# Altium schematic sheet PicoCore-S3.SchDoc
size A3; SheetNumber: 1; SheetTotal: 1
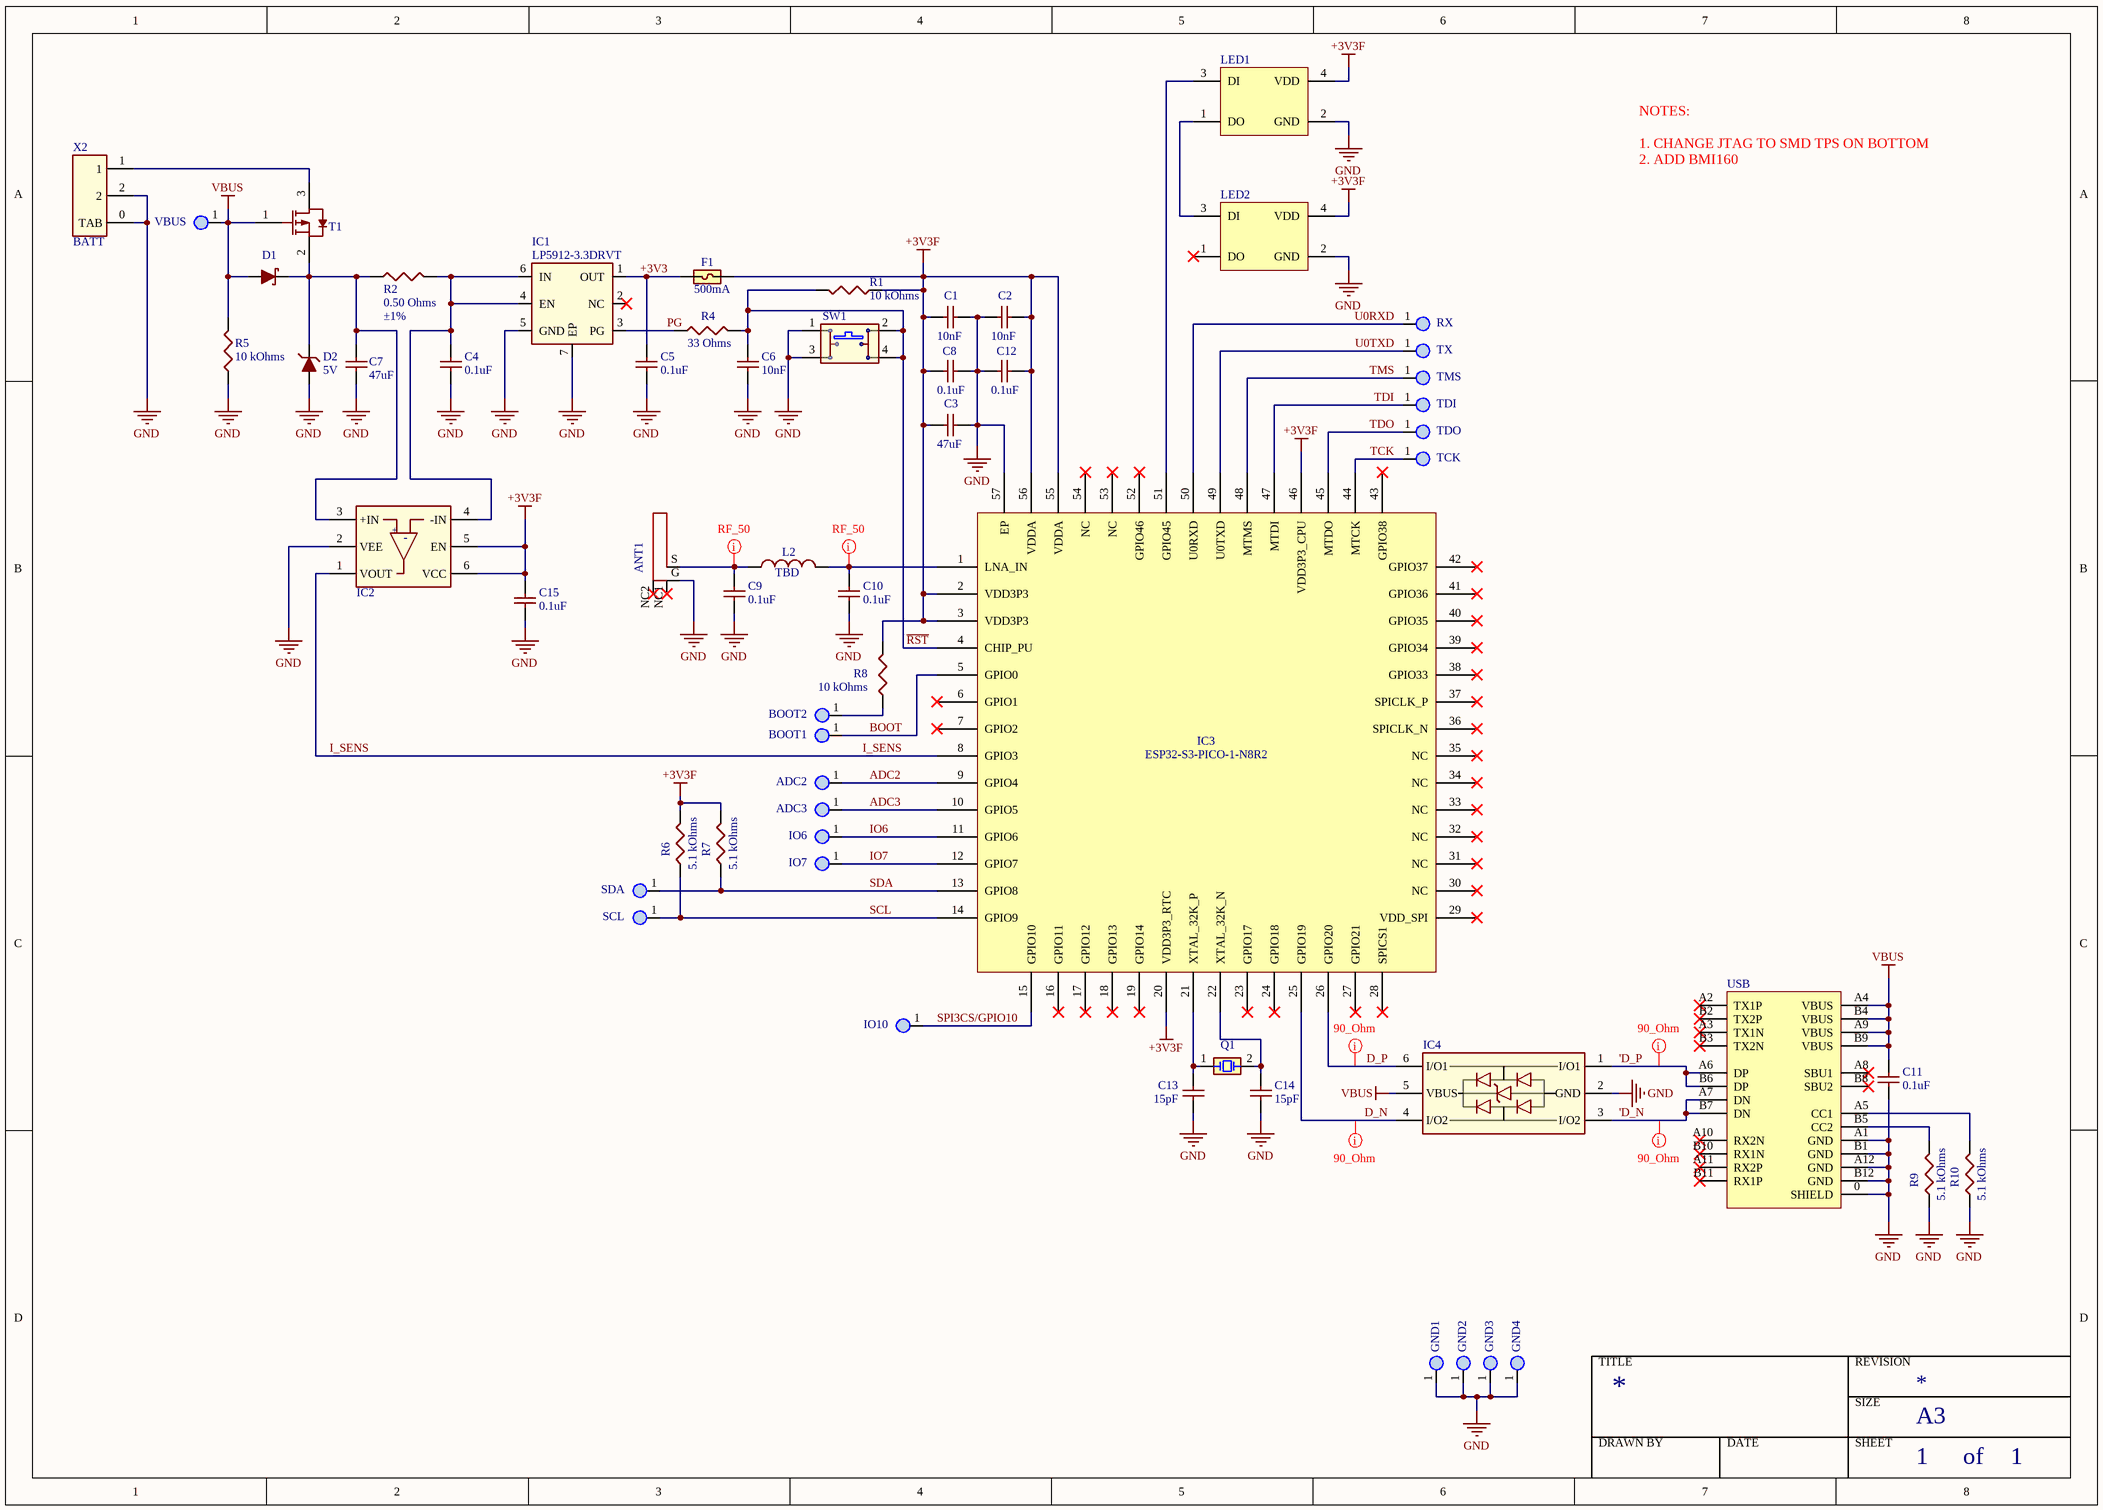
[diagram p0: PicoCore-S3.SchDoc]

## Parts
ADC2  CASTELLATED PAD  [CASTELLATED PAD]  (value not drawn)
ADC3  CASTELLATED PAD  [CASTELLATED PAD]  (value not drawn)
ANT1  RF ANT 2.4GHZ STAMPED MET SLD  [PRO-OB-440]  (value not drawn)
BOOT1  CASTELLATED PAD  [CASTELLATED PAD]  (value not drawn)
BOOT2  CASTELLATED PAD  [CASTELLATED PAD]  (value not drawn)
C1  Electrical Value: 10nF  [CAP_0402_IPC]  (hidden comment: CAP NP)
C2  Electrical Value: 10nF  [CAP_0402_IPC]  (hidden comment: CAP NP)
C3  Electrical Value: 47uF  [CAP_1206_IPC]  (hidden comment: CAP NP)
C4  Electrical Value: 0.1uF  [CAP_0402_IPC]  (hidden comment: CAP NP)
C5  Electrical Value: 0.1uF  [CAP_0402_IPC]  (hidden comment: CAP NP)
C6  Electrical Value: 10nF  [CAP_0402_IPC]  (hidden comment: CAP NP)
C7  Electrical Value: 47uF  [CAP_1206_IPC]  (hidden comment: CAP NP)
C8  Electrical Value: 0.1uF  [CAP_0402_IPC]  (hidden comment: CAP NP)
C9  Electrical Value: 0.1uF  [CAP_0402_IPC]  (hidden comment: CAP NP)
C10  Electrical Value: 0.1uF  [CAP_0402_IPC]  (hidden comment: CAP NP)
C11  Electrical Value: 0.1uF  [CAP_0402_IPC]  (hidden comment: CAP NP)
C12  Electrical Value: 0.1uF  [CAP_0402_IPC]  (hidden comment: CAP NP)
C13  Electrical Value: 15pF  [CAP_0603_IPC]  (hidden comment: CAP NP)
C14  Electrical Value: 15pF  [CAP_0603_IPC]  (hidden comment: CAP NP)
C15  Electrical Value: 0.1uF  [CAP_0402_IPC]  (hidden comment: CAP NP)
D1  DIODE_SCHOTTKY  [SOD-123_IPC]  (value not drawn)
D2  Electrical Value: 5V  [SOD-523_IPC]  (hidden comment: DIODE_TVS_UNI)
F1  Rating1 Value: 500mA  [PTC_1206_IPC]  (hidden comment: FUSE)
GND1  CASTELLATED PAD  [CASTELLATED PAD]  (value not drawn)
GND2  CASTELLATED PAD  [CASTELLATED PAD]  (value not drawn)
GND3  CASTELLATED PAD  [CASTELLATED PAD]  (value not drawn)
GND4  CASTELLATED PAD  [CASTELLATED PAD]  (value not drawn)
IC1  Primary Manufacturer Part Number: LP5912-3.3DRVT  [SON6_0P65_EP_IPC]  (hidden comment: LP5912-3.3)
IC2  NCV2002SN2T1  [TSOP6_0P95_IPC]  (value not drawn)
IC3  RF TXRX MOD BLUETOOTH WIFISMD  [LGA56]  (value not drawn)
IC4  USBLC6-2P6  [SOT666_IPC]  (value not drawn)
IO6  CASTELLATED PAD  [CASTELLATED PAD]  (value not drawn)
IO7  CASTELLATED PAD  [CASTELLATED PAD]  (value not drawn)
IO10  CASTELLATED PAD  [CASTELLATED PAD]  (value not drawn)
L2  TBD  [IND_0805_IPC]
LED1  ADDRESS LED DISCRETE RGB  [WS2812B-2020]  (value not drawn)
LED2  ADDRESS LED DISCRETE RGB  [WS2812B-2020]  (value not drawn)
Q1  CRYSTAL_H_2PIN  [XTAL_ECX-34Q]  (value not drawn)
R1  Electrical Value: 10 kOhms  [RES_0402_IPC]  (hidden comment: RES)
R2  Electrical Value: 0.50 Ohms  Tolerance %: ±1%  [RES_1206_IPC]  (hidden comment: RES)
R4  Electrical Value: 33 Ohms  [RES_0402_IPC]  (hidden comment: RES)
R5  Electrical Value: 10 kOhms  [RES_0402_IPC]  (hidden comment: RES)
R6  Electrical Value: 5.1 kOhms  [RES_0402_IPC]  (hidden comment: RES)
R7  Electrical Value: 5.1 kOhms  [RES_0402_IPC]  (hidden comment: RES)
R8  Electrical Value: 10 kOhms  [RES_0402_IPC]  (hidden comment: RES)
R9  Electrical Value: 5.1 kOhms  [RES_0402_IPC]  (hidden comment: RES)
R10  Electrical Value: 5.1 kOhms  [RES_0402_IPC]  (hidden comment: RES)
RX  CASTELLATED PAD  [CASTELLATED PAD]  (value not drawn)
SCL  CASTELLATED PAD  [CASTELLATED PAD]  (value not drawn)
SDA  CASTELLATED PAD  [CASTELLATED PAD]  (value not drawn)
SW1  SW-RESET  [SW_KMR231GLFS]  (value not drawn)
T1  MOSFET_P-CH  [SOT23-3_IPC]  (value not drawn)
TCK  CASTELLATED PAD  [CASTELLATED PAD]  (value not drawn)
TDI  CASTELLATED PAD  [CASTELLATED PAD]  (value not drawn)
TDO  CASTELLATED PAD  [CASTELLATED PAD]  (value not drawn)
TMS  CASTELLATED PAD  [CASTELLATED PAD]  (value not drawn)
TX  CASTELLATED PAD  [CASTELLATED PAD]  (value not drawn)
USB  CONN RCP USB3.1 TYPEC 24P SMD RA  [12401832E402A]  (value not drawn)
VBUS  CASTELLATED PAD  [CASTELLATED PAD]  (value not drawn)
X2  BATT  [CONN_2POS_SM02B]

## Nets
+3V3F: C1.2 C2.1 C3.2 C8.2 C12.1 C15.2 F1.2 IC2.5(EN) IC2.6(VCC) IC3.2(VDD3P3) IC3.3(VDD3P3) IC3.20(VDD3P3_RTC) IC3.46(VDD3P3_CPU) IC3.55(VDDA) IC3.56(VDDA) LED1.4(VDD) LED2.4(VDD) R1.1 R6.2 R7.2 R8.2
GND: ANT1.G C1.1 C2.2 C3.1 C4.1 C5.1 C6.2 C7.2 C8.1 C9.1 C10.1 C11.1 C12.2 C13.1 C14.1 C15.1 D2.2(A) GND1.1 GND2.1 GND3.1 GND4.1 IC1.5(GND) IC1.7(EP) IC2.2(VEE) IC3.57(EP) IC4.2(GND) LED1.2(GND) LED2.2(GND) R5.1 R9.1 R10.1 SW1.1 SW1.3 USB.0(SHIELD) USB.A1(GND) USB.A12(GND) USB.B1(GND) USB.B12(GND) X2.0(TAB) X2.2
VBUS: C11.2 D1.2(A) IC4.5(VBUS) R5.2 T1.1(G) USB.A4(VBUS) USB.A9(VBUS) USB.B4(VBUS) USB.B9(VBUS) VBUS.1
'D_N: IC4.3(I/O2) USB.A7(DN) USB.B7(DN)
'D_P: IC4.1(I/O1) USB.A6(DP) USB.B6(DP)
+3V3: C5.2 F1.1 IC1.1(OUT)
ADC2: ADC2.1 IC3.9(GPIO4)
ADC3: ADC3.1 IC3.10(GPIO5)
BOOT: BOOT1.1 IC3.5(GPIO0)
D_N: IC3.25(GPIO19) IC4.4(I/O2)
D_P: IC3.26(GPIO20) IC4.6(I/O1)
I_SENS: IC2.1(VOUT) IC3.8(GPIO3)
IO6: IC3.11(GPIO6) IO6.1
IO7: IC3.12(GPIO7) IO7.1
PG: IC1.3(PG) R4.1
~{RST}: C6.1 IC3.4(CHIP_PU) R1.2 R4.2 SW1.2 SW1.4
SCL: IC3.14(GPIO9) R6.1 SCL.1
SDA: IC3.13(GPIO8) R7.1 SDA.1
SPI3CS/GPIO10: IC3.15(GPIO10) IO10.1
TCK: IC3.44(MTCK) TCK.1
TDI: IC3.47(MTDI) TDI.1
TDO: IC3.45(MTDO) TDO.1
TMS: IC3.48(MTMS) TMS.1
U0RXD: IC3.50(U0RXD) RX.1
U0TXD: IC3.49(U0TXD) TX.1
NetANT1_S: ANT1.S C9.2 L2.1
NetBOOT2_1: BOOT2.1 R8.1
NetC4_2: C4.2 IC1.4(EN) IC1.6(IN) IC2.4(-IN) R2.2
NetC7_1: C7.1 D1.1(K) D2.1(K) IC2.3(+IN) R2.1 T1.2(S)
NetC10_2: C10.2 IC3.1(LNA_IN) L2.2
NetC13_2: C13.2 IC3.21(XTAL_32K_P) Q1.1(I/O@1)
NetC14_2: C14.2 IC3.22(XTAL_32K_N) Q1.2(I/O@2)
NetIC3_51: IC3.51(GPIO45) LED1.3(DI)
NetLED1_1: LED1.1(DO) LED2.3(DI)
NetR9_2: R9.2 USB.B5(CC2)
NetR10_2: R10.2 USB.A5(CC1)
NetT1_3: T1.3(D) X2.1

Not connected (* = marked no-connect by the designer): ANT1 NC1* NC2*; IC1 2(NC)*; IC3 6(GPIO1)* 7(GPIO2)* 16(GPIO11)* 17(GPIO12)* 18(GPIO13)* 19(GPIO14)* 23(GPIO17)* 24(GPIO18)* 27(GPIO21)* 28(SPICS1)* 29(VDD_SPI)* 30(NC)* 31(NC)* 32(NC)* 33(NC)* 34(NC)* 35(NC)* 36(SPICLK_N)* 37(SPICLK_P)* 38(GPIO33)* 39(GPIO34)* 40(GPIO35)* 41(GPIO36)* 42(GPIO37)* 43(GPIO38)* 52(GPIO46)* 53(NC)* 54(NC)*; LED2 1(DO)*; USB A2(TX1P)* A3(TX1N)* A8(SBU1)* A10(RX2N)* A11(RX2P)* B2(TX2P)* B3(TX2N)* B8(SBU2)* B10(RX1N)* B11(RX1P)*

## Layout directives
net class DIFF_90: 'D_N, 'D_P, D_N, D_P
net class RF_50: NetANT1_S, NetC10_2

## Notes on the sheet
- NOTES:
  1. CHANGE JTAG TO SMD TPS ON BOTTOM
  2. ADD BMI160
- TITLE
- REVISION
- DRAWN BY
- DATE
- SHEET
- SIZE
- A3
- of
- (in symbol NCV2002SN2T1G) +; -

## Library data of the parts
ADC2 ADC3 BOOT1 BOOT2 GND1-GND4 IO6 IO7 IO10 RX SCL SDA TCK TDI TDO TMS TX VBUS = CASTELLATED_PAD
ANT1 = PRO-OB-440: RF ANTENNA Bluetooth, WirelessHART, WLAN, Zigbee™ Stamped Metal Solder Surface Mount; Primary Manufacturer: Abracon; Primary Manufacturer Part Number: PRO-OB-440; Electrical Value: 2.4 GHz
C1 C2 C6 = CGA2B3X7R1H103K050BB: CAP CER 10nF 10% 50V X7R 0402; Methode Part Number: 18191XA86; Primary Manufacturer: TDK Corporation; Part Height in mm: 0.55; Temperature  Min C: -55; Temperature  Max C: 125; Qualification: AEC-Q200; Primary Manufacturer Part Number: CGA2B3X7R1H103K050BB; Rating1 Value: 50V; Package: 0402; Tolerance %: ±10%; ROHS Compliant: True
C3 C7 = C3216X5R1E476M160AC: Capacitor Ceramic 47UF 25V 20% X5R 1206; Methode Part Number: TBD; Primary Manufacturer: Kemet; Part Height in mm: 1.8; Temperature  Min C: -55; Temperature  Max C: 85; Qualification: General purpose; Primary Manufacturer Part Number: C3216X5R1E476M160AC; Rating1 Value: 25V; Package: 1206; Tolerance %: ±20%; ROHS Compliant: True
C4 C5 C8-C12 C15 = GCM155R71H104KE02D: CAP CER 0.1uF 10% 50V X7R 0402; Methode Part Number: 18191XA98; Primary Manufacturer: Murata Electronics North America; Part Height in mm: 0.55; Temperature  Min C: -55; Temperature  Max C: 125; Qualification: AEC-Q200; Primary Manufacturer Part Number: GCM155R71H104KE02D; Rating1 Value: 50V; Package: 0402; Tolerance %: ±10%; ROHS Compliant: True
C13 C14 = C0603C150J5GACTU: Capacitor Ceramic NPO, SMT, 15PF, 50V, 5%, 0603; Primary Manufacturer: KEMET CHARGED ELECTRONICS; Part Height in mm: 0.8; Temperature  Min C: -55; Temperature  Max C: 125; Qualification: NO; Primary Manufacturer Part Number: C0603C150J5GACTU; Rating1 Value: 50V; Package: 0603; Tolerance %: 5%; ROHS Compliant: True
D1 = MBR0540-TP: DIODE SCHOTTKY 40V 500MA SOD123; Methode Part Number: TBD; Primary Manufacturer: Micro Commercial Co; Part Height in mm: 1.35; Temperature  Min C: -55; Temperature  Max C: 150; Certification: UL 94V-0; Qualification: General purpose; Primary Manufacturer Part Number: MBR0540-TP; Electrical Value: 40V; Rating1 Value: 500mA; Package: SOD123; ROHS Compliant: True
D2 = ESD5Z5.0T1G: Zener Diode, SMT, TVS, ESD, 5.0V, SOD-523; Methode Part Number: 16441XA7; Primary Manufacturer: ON SEMICONDUCTORS; Part Height in mm: 0.6; Rating1 Value: 200 W; Temperature  Min C: -55; Temperature  Max C: 150; Qualification: Automotive; Primary Manufacturer Part Number: ESD5Z5.0T1G; Package: SOD-523; ROHS Compliant: True
F1 = 0ZCJ0050AF2E: PTC RESET FUSE 24V 500MA 1206; Methode Part Number: TBD; Primary Manufacturer: Bel Fuse Inc.; Part Height in mm: 1.2; Temperature  Min C: -40; Temperature  Max C: 85; Qualification: AEC-Q200; Primary Manufacturer Part Number: 0ZCJ0050AF2E; Electrical Value: 24V; Package: 1206; ROHS Compliant: True
IC1 = LP5912-3.3DRVT: IC REG LDO 3.3V 0.5A 6SON; Methode Part Number: TBD; Primary Manufacturer: Texas Instruments; Part Height in mm: 0.8; Rating1 Value: 500mA; Temperature  Min C: -40; Temperature  Max C: 125; Qualification: General purpose; Electrical Value: 3.3V; Package: SON-6; ROHS Compliant: TRUE
IC2 = NCV2002SN2T1G: IC OPAMP 1-CIRCUIT RAIL-TO-RAIL TSOP-6; Methode Part Number: 16455XA64; Primary Manufacturer: ON Semiconductor; Part Height in mm: 1.1; Electrical Value: 7V; Rating1 Value: 340mW; Temperature  Min C: -40; Temperature  Max C: 125; Qualification: AEC-Q100; Primary Manufacturer Part Number: NCV2002SN2T1G; Package: TSOP-6; ROHS Compliant: True
IC3 = ESP32-S3-PICO-1-N8R2: Bluetooth, WiFi 802.11b/g/n, Bluetooth v5.0 Transceiver Module 2.4GHz Antenna Not Included Surface Mount; Primary Manufacturer: Espressif Systems; Part Height in mm: 1.06; Electrical Value: 3.0V~3.6V; Temperature Min C: -40; Temperature Max C: +85; ComponentLink1Description: Datasheet; ComponentLink1URL: https://www.espressif.com/sites/default/files/documentation/esp32-s3-pico-1_datasheet_en.pdf; Primary Manufacturer Part Number: ESP32-S3-PICO-1-N8R2
IC4 = USBLC6-2P6: TVS DIODE 5.25V 17VC SOT-666; Methode Part Number: TBD; Primary Manufacturer: STMicroelectronics; Part Height in mm: 0.6; Rating1 Value: 5A; Temperature  Min C: -40; Temperature  Max C: 125; Qualification: General Purpose; Primary Manufacturer Part Number: USBLC6-2P6; Electrical Value: 5.25V; Package: SOT-666; ROHS Compliant: True; ComponentLink1Description: Datasheet; ComponentLink1URL: https://www.st.com/resource/en/datasheet/usblc6-2.pdf
L2 = BLM21AG102SN1D: CHIP BEAD 1K OHM 600mA 0805; Primary Manufacturer: Murata Electronics North America; Part Height in mm: 1.05; Electrical Value: 1K Ohms; Rating2 Value: 270 mOhms; Temperature  Min C: -55; Temperature  Max C: 125; Qualification: General Purpose; Primary Manufacturer Part Number: BLM21AG102SN1D; Methode Part Number: TBD; Rating1 Value: 600mA; Package: 0805; ROHS Compliant: True
LED1 LED2 = WS2812B-2020: Addressable Lighting Neopixel 10 LED Discrete Red, Green, Blue (RGB) 2.00mm L x 2.00mm W
Q1 = ECS-.327-12.5-34R-C-TR: CRYSTAL 32.768KHZ 12.5PF SMD-2; Methode Part Number: TBD; Primary Manufacturer: ECS Inc.; Part Height in mm: 0.9; Rating2 Value: 50 kOhms; Temperature  Min C: -40; Temperature  Max C: 85; Qualification: General purpose; Primary Manufacturer Part Number: ECS-.327-12.5-34R-C-TR; Electrical Value: 32.768KHz; Rating1 Value: 12.5pF; Package: SMD-2; ROHS Compliant: True
R1 R5 R8 = RC0402FR-0710KL: RES SMD 10K OHM 1% 1/16W 0402; Methode Part Number: TBD; Primary Manufacturer: Yageo; Part Height in mm: 0.4; Rating1 Value: 62.5 mW; Rating2 Value: 50V; Temperature  Min C: -55; Temperature  Max C: 155; Qualification: General purpose; Primary Manufacturer Part Number: RC0402FR-0710KL; Package: 0402; Tolerance %: ±1%; ROHS Compliant: True
R2 = RCWE1206R240FKEA: RES SMD 0.250 OHM 1% 1/2W 1206; Primary Manufacturer Part Number: CSR1206FTR500; Methode Part Number: TBD_0E24; Primary Manufacturer: Vishay Dale; Part Height in mm: 0.7; Rating1 Value: 0.5W; Rating2 Value: 300V; Temperature  Min C: -55; Temperature  Max C: 155; Qualification: AEC-Q200; Package: 1206; ROHS Compliant: True
R4 = RK73H1ETTP33R0F: RES SMD 33 OHM 1% 1/10W 0402; Methode Part Number: TBD; Primary Manufacturer: KOA Speer; Part Height in mm: 0.4; Rating1 Value: 100 mW; Rating2 Value: 75V; Temperature  Min C: -55; Temperature  Max C: 155; Qualification: AEC-Q200; Primary Manufacturer Part Number: RK73H1ETTP33R0F; Package: 0402; Tolerance %: ±1%; ROHS Compliant: True
R6 R7 R9 R10 = RC0402FR-075K1L: RES SMD 5.1K OHM 1% 1/16W 0402; Methode Part Number: TBD; Primary Manufacturer: Yageo; Part Height in mm: 0.4; Rating1 Value: 62.5 mW; Rating2 Value: 50V; Temperature  Min C: -55; Temperature  Max C: 155; Qualification: General purpose; Primary Manufacturer Part Number: RC0402FR-075K1L; Package: 0402; Tolerance %: ±1%; ROHS Compliant: True
SW1 = KMR231GLFS: SWITCH TACTILE SPST-NO 0.05A 32V; Methode Part Number: TBD; Primary Manufacturer: C&K Components; Part Height in mm: 1.9; Electrical Value: 50mA; Rating1 Value: 32VDC; Temperature  Min C: -40; Temperature  Max C: 85; QualifiCATION: Automotive; Primary Manufacturer Part Number: KMR231GLFS; ROHS Compliant: True
T1 = IRLML6402TRPBF: MOSFET P-CH 20V 3.7A SOT-23; Methode Part Number: TBD; Primary Manufacturer: International Rectifier; Part Height in mm: 1.12; Temperature  Min C: -55; Temperature  Max C: 150; Qualification: General Purpose; Primary Manufacturer Part Number: IRLML6402TRPBF; Electrical Value: 20V; Rating1 Value: 3.7A; Package: SOT-23; ROHS Compliant: True
USB = 12401832E402A: USB-C (USB TYPE-C) USB 3.2 Gen 2 (USB 3.1 Gen 2, Superspeed + (USB 3.1)) Receptacle Connector 24 Position Surface Mount, Right Angle; Through Hole; Primary Manufacturer: Amphenol; Temp Min C: -40; Temp Max C: +85; Primary Manufacturer Part Number: 12401832E402A
X2 = SM02B-GHS-TB(LF)(SN): CONN HEADER R/A 2POS 1.25mm SMD; Methode Part Number: TBD; Primary Manufacturer: JST Sales America Inc.; Part Height in mm: 4.25; Rating1 Value: 1A; Rating2 Value: 50V; Temperature  Min C: -25; Temperature  Max C: 85; Automotive Qualified: UL94 V-0; Primary Manufacturer Part Number: SM02B-GHS-TB(LF)(SN); Electrical Value: 2POS; Package: SMD; ROHS Compliant: YES